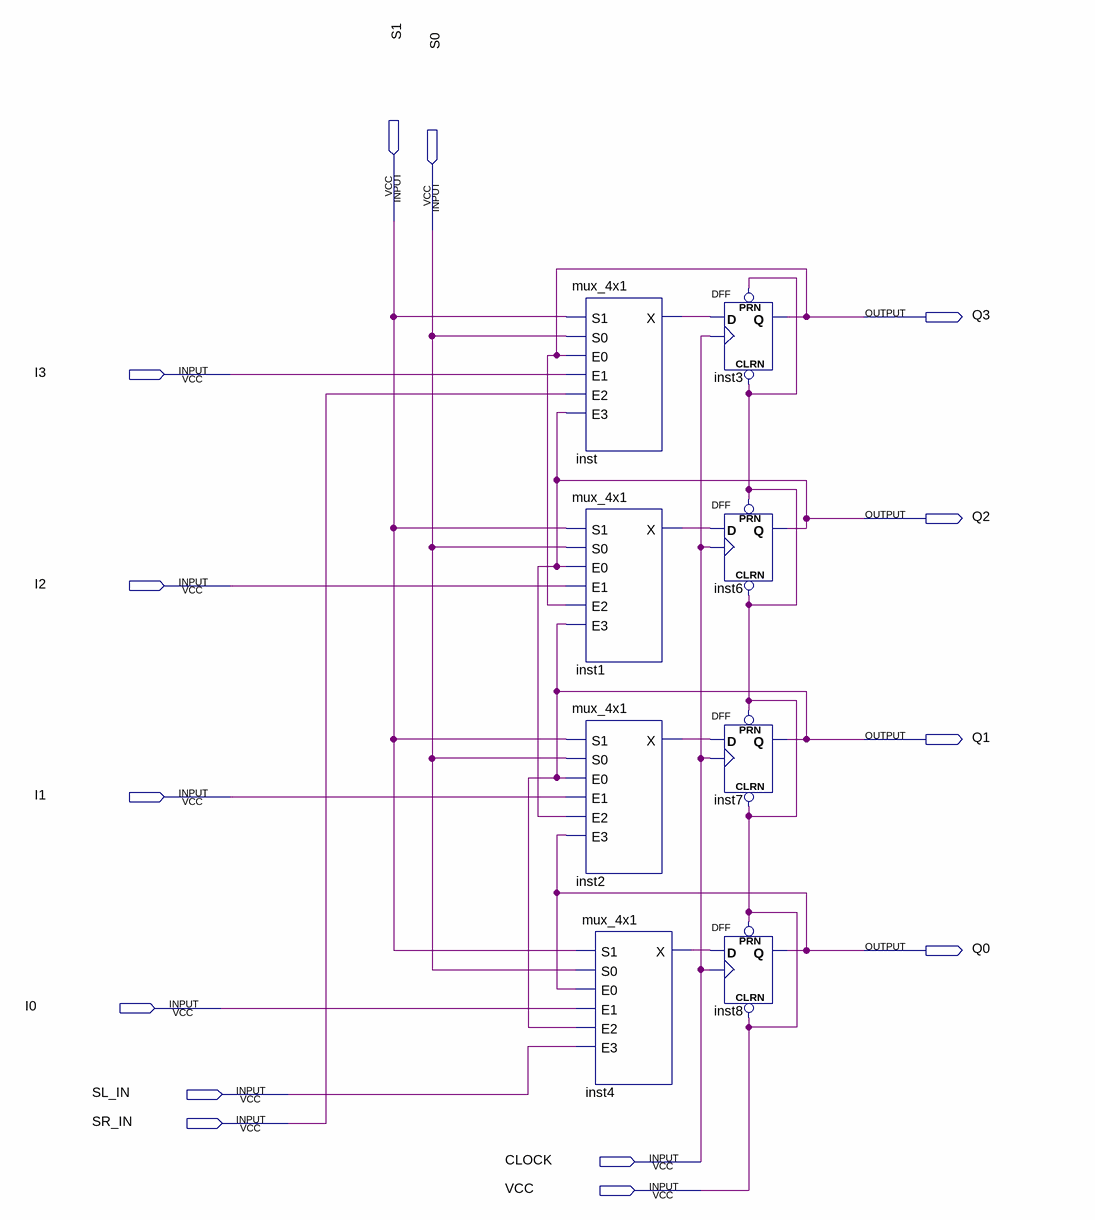
[diagram p0: schematic sheet]
// Quartus schematic reg.bdf as structural Verilog: 8 symbols, 14 pins
module \reg  (
  input  S1,
  input  S0,
  input  I3,
  input  I2,
  input  I1,
  input  I0,
  input  SL_IN,
  input  SR_IN,
  input  CLOCK,
  input  VCC,
  output Q3,
  output Q2,
  output Q1,
  output Q0
);

  wire inst1_x, inst2_x, inst4_x, inst_x;

  mux_4x1 inst (.S1(S1), .S0(S0), .E0(Q3), .E1(I3), .E2(SR_IN), .E3(Q2), .X(inst_x));
  mux_4x1 inst1 (.S1(S1), .S0(S0), .E0(Q2), .E1(I2), .E2(Q3), .E3(Q1), .X(inst1_x));
  mux_4x1 inst2 (.S1(S1), .S0(S0), .E0(Q1), .E1(I1), .E2(Q2), .E3(Q0), .X(inst2_x));
  mux_4x1 inst4 (.S1(S1), .S0(S0), .E0(Q0), .E1(I0), .E2(Q1), .E3(SL_IN), .X(inst4_x));
  DFF inst3 (.CLRN(VCC), .CLK(CLOCK), .D(inst_x), .PRN(VCC), .Q(Q3));
  DFF inst6 (.CLRN(VCC), .CLK(CLOCK), .D(inst1_x), .PRN(VCC), .Q(Q2));
  DFF inst7 (.CLRN(VCC), .CLK(CLOCK), .D(inst2_x), .PRN(VCC), .Q(Q1));
  DFF inst8 (.CLRN(VCC), .CLK(CLOCK), .D(inst4_x), .PRN(VCC), .Q(Q0));
endmodule
